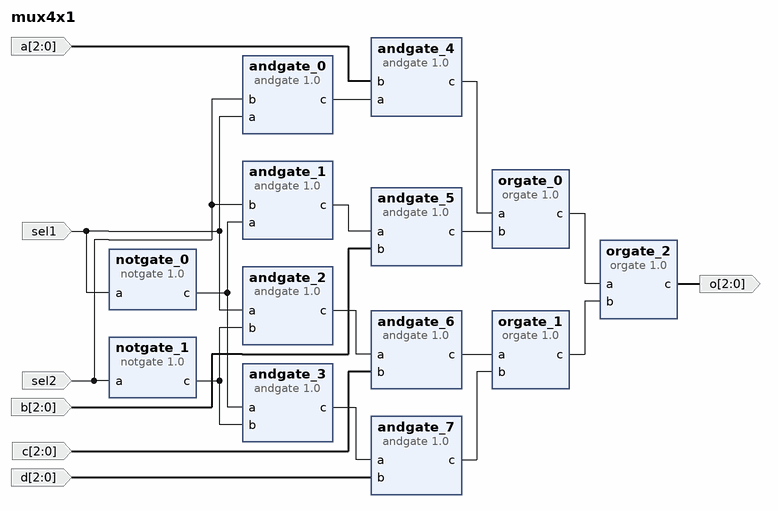
[diagram p0: block diagram of the top level]
# Vivado block design mux4x1, Vivado 2015.2
create_bd_design mux4x1

create_bd_port -dir I sel1
create_bd_port -dir I sel2
create_bd_port -dir I -from 2 -to 0 a
create_bd_port -dir I -from 2 -to 0 b
create_bd_port -dir I -from 2 -to 0 c
create_bd_port -dir I -from 2 -to 0 d
create_bd_port -dir O -from 2 -to 0 o

create_bd_cell -type ip -vlnv xilinx.com:user:orgate:1.0 orgate_0
create_bd_cell -type ip -vlnv xilinx.com:user:andgate:1.0 andgate_0
create_bd_cell -type ip -vlnv xilinx.com:user:notgate:1.0 notgate_0
create_bd_cell -type ip -vlnv xilinx.com:user:andgate:1.0 andgate_1
create_bd_cell -type ip -vlnv xilinx.com:user:andgate:1.0 andgate_2
create_bd_cell -type ip -vlnv xilinx.com:user:andgate:1.0 andgate_3
create_bd_cell -type ip -vlnv xilinx.com:user:notgate:1.0 notgate_1
create_bd_cell -type ip -vlnv xilinx.com:user:andgate:1.0 andgate_4
create_bd_cell -type ip -vlnv xilinx.com:user:andgate:1.0 andgate_5
create_bd_cell -type ip -vlnv xilinx.com:user:andgate:1.0 andgate_6
create_bd_cell -type ip -vlnv xilinx.com:user:andgate:1.0 andgate_7
create_bd_cell -type ip -vlnv xilinx.com:user:orgate:1.0 orgate_1
create_bd_cell -type ip -vlnv xilinx.com:user:orgate:1.0 orgate_2

# ---- connections ----

connect_bd_net -net sel1_1 [get_bd_ports sel1] [get_bd_pins notgate_0/a] [get_bd_pins andgate_0/a] [get_bd_pins andgate_2/a]
connect_bd_net -net sel2_1 [get_bd_ports sel2] [get_bd_pins notgate_1/a] [get_bd_pins andgate_0/b] [get_bd_pins andgate_1/b]
connect_bd_net [get_bd_pins notgate_0/c] [get_bd_pins andgate_1/a] [get_bd_pins andgate_3/a]
connect_bd_net [get_bd_pins notgate_1/c] [get_bd_pins andgate_2/b] [get_bd_pins andgate_3/b]
connect_bd_net [get_bd_pins andgate_0/c] [get_bd_pins andgate_4/a]
connect_bd_net [get_bd_ports a] [get_bd_pins andgate_4/b]
connect_bd_net [get_bd_pins andgate_1/c] [get_bd_pins andgate_5/a]
connect_bd_net [get_bd_ports b] [get_bd_pins andgate_5/b]
connect_bd_net [get_bd_pins andgate_2/c] [get_bd_pins andgate_6/a]
connect_bd_net [get_bd_ports c] [get_bd_pins andgate_6/b]
connect_bd_net [get_bd_pins andgate_3/c] [get_bd_pins andgate_7/a]
connect_bd_net [get_bd_ports d] [get_bd_pins andgate_7/b]
connect_bd_net [get_bd_pins andgate_4/c] [get_bd_pins orgate_0/a]
connect_bd_net [get_bd_pins andgate_5/c] [get_bd_pins orgate_0/b]
connect_bd_net [get_bd_pins andgate_6/c] [get_bd_pins orgate_1/a]
connect_bd_net [get_bd_pins andgate_7/c] [get_bd_pins orgate_1/b]
connect_bd_net [get_bd_pins orgate_0/c] [get_bd_pins orgate_2/a]
connect_bd_net [get_bd_pins orgate_1/c] [get_bd_pins orgate_2/b]
connect_bd_net [get_bd_pins orgate_2/c] [get_bd_ports o]

validate_bd_design
save_bd_design
